# EasyEDA Pro project 407vet6_imu_car.eprj, board PCB_PCB_彩屏_2022-3-24_2025-01-23
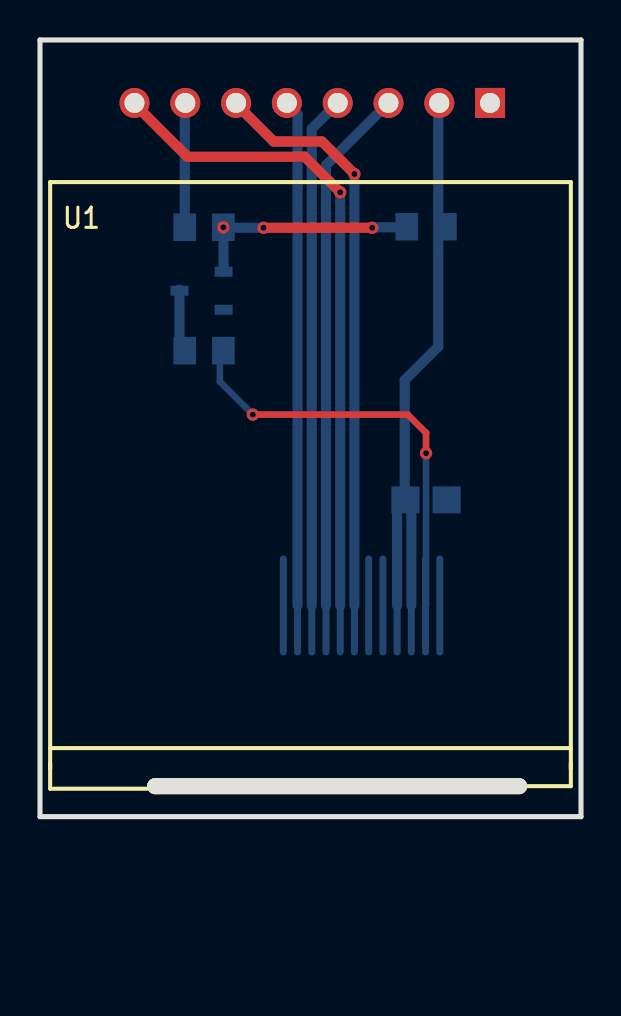
[diagram p4: board, top side]
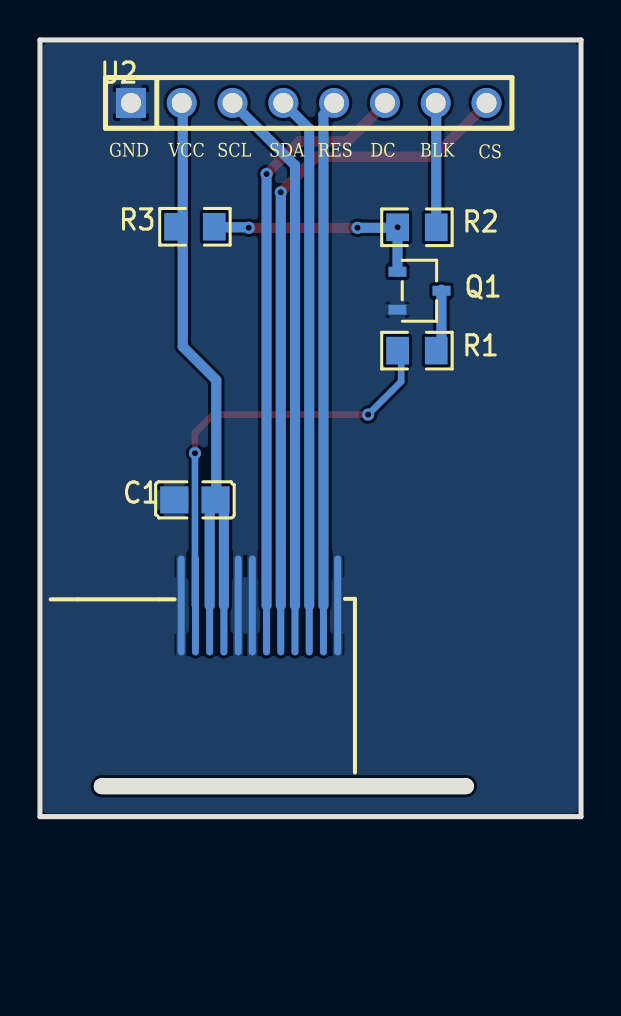
[diagram p5: board, bottom side, seen from below]

Outline 27.05 x 38.86 mm; copper layers: Top Layer, Bottom Layer. Coordinates in mm from the lower left corner of the outline.
Outline path: 0,38.86 27.05,38.86 27.05,0 0,0 0,38.86

## Design rules (mm)
spacing Default (default): track to track 0.152, other pairs 0 to 0.152
track width Default (default): min 0.254, default 0.254, max 25.4
via Default (default): diameter min 0.61, default 0.61, max 100.025; hole min 0.305, default 0.305, max 59.995
pour e31 uses gge4524

## Placement (name value [footprint] x y rotation side)
C1  0.1u  [C0805]  19.3 15.85 180 bottom
Q1  S8050  [SS8050-F722]  8.08 26.31 0 bottom
R1  10  [R0805]  8.2 23.32 0 bottom
R2  1k  [R0805]  8.2 29.49 0 bottom
R3  10K  [R0805]  19.3 29.51 180 bottom
U1  ST7789V-12PIN 1.3寸LCD  [ST7789V-12PIN]  0.51 1.4 0 top
U2  X5511WV-08-C35D35-1000  [HDR-TH_8P-P2.54-V-M]  13.61 35.71 180 bottom

## Footprints (pads in the part's own frame, mm; a bottom-side part is the same pattern mirrored in y, then rotated)
C0805
  rect 1.41x1.35 smd: 1(-1.03,0) 2(1.03,0)
HDR-TH_8P-P2.54-V-M
  rect 1.5x1.5 hole 1: 1(-8.89,0)
  round 1.5 hole 1: 2(-6.35,0) 3(-3.81,0) 4(-1.27,0) 5(1.27,0) 6(3.81,0) 7(6.35,0) 8(8.89,0)
R0805
  rect 1.133x1.377 smd: 1(-0.966,0) 2(0.966,0)
SS8050-F722
  rect 0.9x0.5 smd: 1(1.101,-0.95) 2(1.101,0.95) 3(-1.101,0)
ST7789V-12PIN
  oval 19x0.8 hole 19x0.8: (14.351,0.127)
  custom 0.35x4.999 smd far side: 1(19.482,9.169) 2(18.77,9.169) 3(18.059,9.169) 4(17.348,9.169) 5(16.637,9.169) 6(15.926,9.169) 7(15.214,9.169) 8(14.504,9.169) 9(13.792,9.169) 10(13.081,9.169) 11(12.37,9.169) 12(11.659,9.169)

## Nets
As in the schematic.

## Via types
v1: diameter 0.61, hole 0.305, Top Layer to Bottom Layer, 7 vias

## Routing (per net, layer and track width the routed paths; a pad name or vN(x,y) marks a point on that pad's centre or on a via; arc(x,y) is an arc through that point)
VCC: length 31.5
  Bottom Layer w0.508: U1.3 18.57,15.56 C1.2 ; 19.96,35.69 19.91,35.64 19.91,28.45 ; U1.4 17.86,15.43 C1.2 ; 19.91,28.45 19.91,23.52 18.24,21.84 18.24,15.85 C1.2
BLK: length 6.2
  Bottom Layer w0.508: 7.24,35.69 R2.1
CS: length 32.8
  Top Layer w0.508: v1(15.01,31.24) 13.23,33.02 7.37,33.02 4.7,35.69
  Bottom Layer w0.508: U1.8 v1(15.01,31.24)
DC: length 29
  Top Layer w0.508: 9.78,35.69 11.68,33.78 14.1,33.78 v1(15.72,32.16)
  Bottom Layer w0.508: U1.7 v1(15.72,32.16)
Q1_1: length 11.1
  Top Layer w0.508: v1(11.18,29.46) v1(16.61,29.46)
  Bottom Layer w0.508: v1(9.17,29.49) 9.2,29.46 v1(11.18,29.46) ; 17.98,29.49 16.64,29.49 v1(16.61,29.46) ; 9.17,29.49 Q1.1
Q1_3: length 3.1
  Bottom Layer w0.508: 7.06,23.32 6.98,23.4 6.98,26.36
R1_2: length 21.6
  Top Layer w0.33: v1(10.64,20.12) 18.39,20.12 19.3,19.2 v1(19.3,18.19)
  Bottom Layer w0.33: v1(10.64,20.12) 8.99,21.77 8.99,23.32 ; U1.2 19.3,10.59 v1(19.3,18.19)
RES: length 25.4
  Bottom Layer w0.508: 12.32,35.69 12.88,35.13 12.88,10.57
SCL: length 26.4
  Bottom Layer w0.508: 17.4,35.69 14.3,32.59 U1.9
SDA: length 25.6
  Bottom Layer w0.508: 14.86,35.69 13.59,34.42 U1.10

## Copper pours and planes (outline as drawn; the poured copper is in the pictures)
GND on Bottom Layer: -3.45,39.93 -3.61,39.78 -3.61,-1.63 -3.3,-1.93 31.39,-1.93 31.75,-1.58 31.75,40.39

## Text on the board
Bottom Silkscreen Layer: CS | BLK | DC | RES | SDA | SCL | VCC | GND
